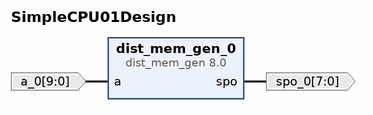
[diagram p0: block diagram of the top level]
# Vivado block design SimpleCPU01Design, xc7vx485tffg1157-1, Vivado 2021.2
create_bd_design SimpleCPU01Design

create_bd_port -dir I -from 9 -to 0 a_0
create_bd_port -dir O -from 7 -to 0 spo_0

create_bd_cell -type ip -vlnv xilinx.com:ip:dist_mem_gen:8.0 dist_mem_gen_0
set_property -dict [list \
  CONFIG.coefficient_file ../../../../../../../Coe/InstrMemCoe.coe \
  CONFIG.data_width 8 \
  CONFIG.depth 1024 \
  CONFIG.input_options non_registered \
  CONFIG.memory_type rom \
] [get_bd_cells dist_mem_gen_0]

# ---- connections ----

connect_bd_net -net a_0_1 [get_bd_ports a_0] [get_bd_pins dist_mem_gen_0/a]
connect_bd_net [get_bd_pins dist_mem_gen_0/spo] [get_bd_ports spo_0]

validate_bd_design
save_bd_design
